# Altium schematic sheet Signal.schdoc
size 508 x 304 mm
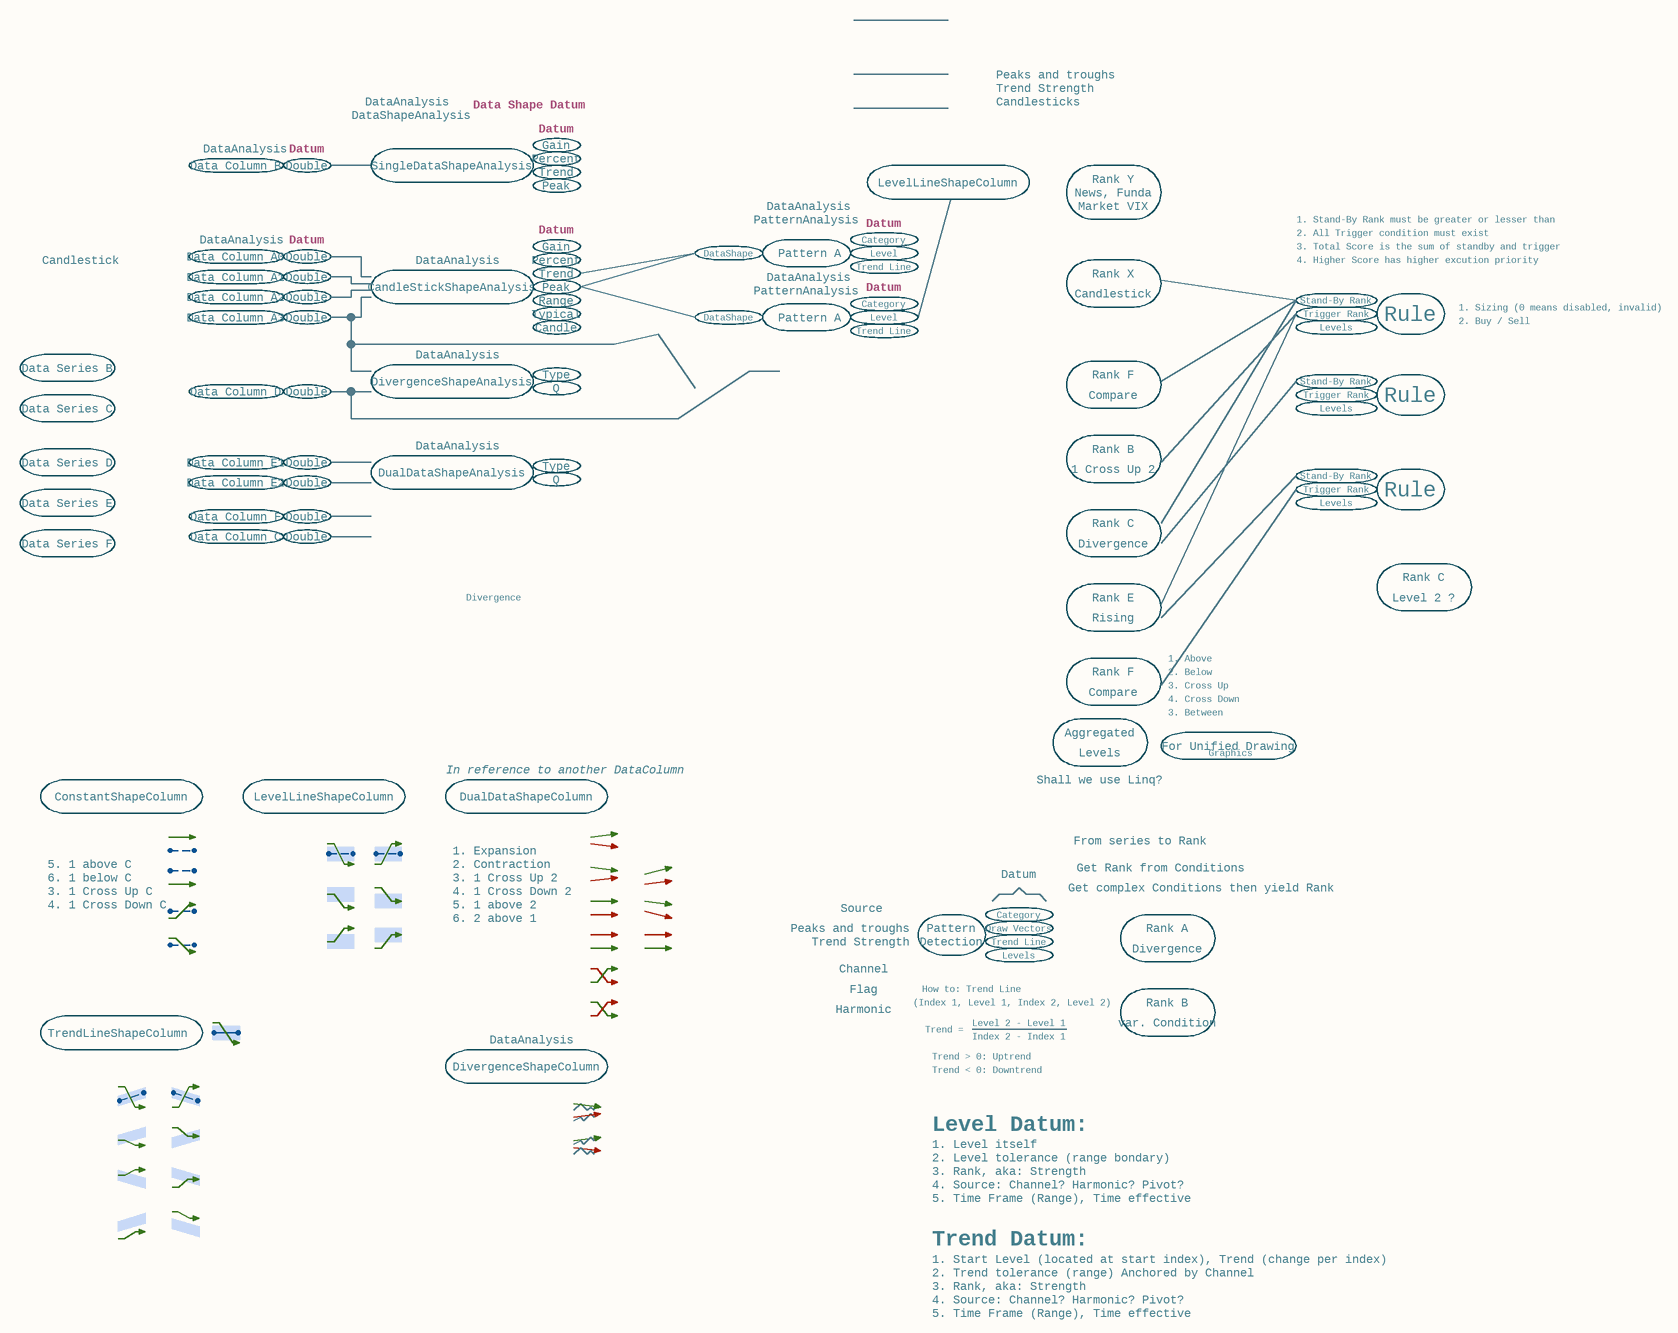
[diagram p0: Signal.schdoc]

## Notes on the sheet
- DataAnalysis
- DataShapeAnalysis
- Data Shape Datum
- Datum
- Peaks and troughs
- Trend Strength
- Candlesticks
- Data Column B
- Double
- SingleDataShapeAnalysis
- Gain
- Percent
- Trend
- Peak
- LevelLineShapeColumn
- Rank Y
- News, Funda
- Candlestick
- Data Column A0
- DataShape
- PatternAnalysis
- Pattern A
- Trend Line
- Level
- Category
- Rank X
- Market VIX
- 1. Stand-By Rank must be greater or lesser than
- 2. All Trigger condition must exist
- 3. Total Score is the sum of standby and trigger
- 4. Higher Score has higher excution priority
- Data Column A1
- Data Column A2
- Data Column A3
- CandleStickShapeAnalysis
- Range
- Typical
- Candle
- Levels
- Trigger Rank
- Stand-By Rank
- Rule
- 1. Sizing (0 means disabled, invalid)
- 2. Buy / Sell
- Data Series B
- Data Series C
- Data Column D
- DivergenceShapeAnalysis
- Type
- Q
- Rank F
- Compare
- Data Series D
- Data Column E1
- DualDataShapeAnalysis
- Rank B
- 1 Cross Up 2
- Data Series E
- Data Series F
- Data Column C
- Data Column E2
- Data Column F
- Rank C
- Divergence
- Rank E
- Level 2 ?
- Rising
- 1. Above
- 2. Below
- Aggregated
- 3. Between
- 3. Cross Up
- 4. Cross Down
- ConstantShapeColumn
- In reference to another DataColumn
- DualDataShapeColumn
- Shall we use Linq?
- Graphics
- For Unified Drawing
- 5. 1 above C
- 6. 1 below C
- 1. Expansion
- 2. Contraction
- 3. 1 Cross Up 2
- From series to Rank
- Get Rank from Conditions
- 3. 1 Cross Up C
- 4. 1 Cross Down C
- 4. 1 Cross Down 2
- 5. 1 above 2
- 6. 2 above 1
- Source
- Pattern
- Detection
- Draw Vectors
- Rank A
- Get complex Conditions then yield Rank
- Channel
- Flag
- Harmonic
- How to: Trend Line
- (Index 1, Level 1, Index 2, Level 2)
- TrendLineShapeColumn
- DivergenceShapeColumn
- Trend > 0: Uptrend
- Trend < 0: Downtrend
- Trend =
- Level 2 - Level 1
- Index 2 - Index 1
- var. Condition
- Level Datum:
- 1. Level itself
- 4. Source: Channel? Harmonic? Pivot?
- 3. Rank, aka: Strength
- 2. Level tolerance (range bondary)
- 5. Time Frame (Range), Time effective
- Trend Datum:
- 1. Start Level (located at start index), Trend (change per index)
- 2. Trend tolerance (range) Anchored by Channel